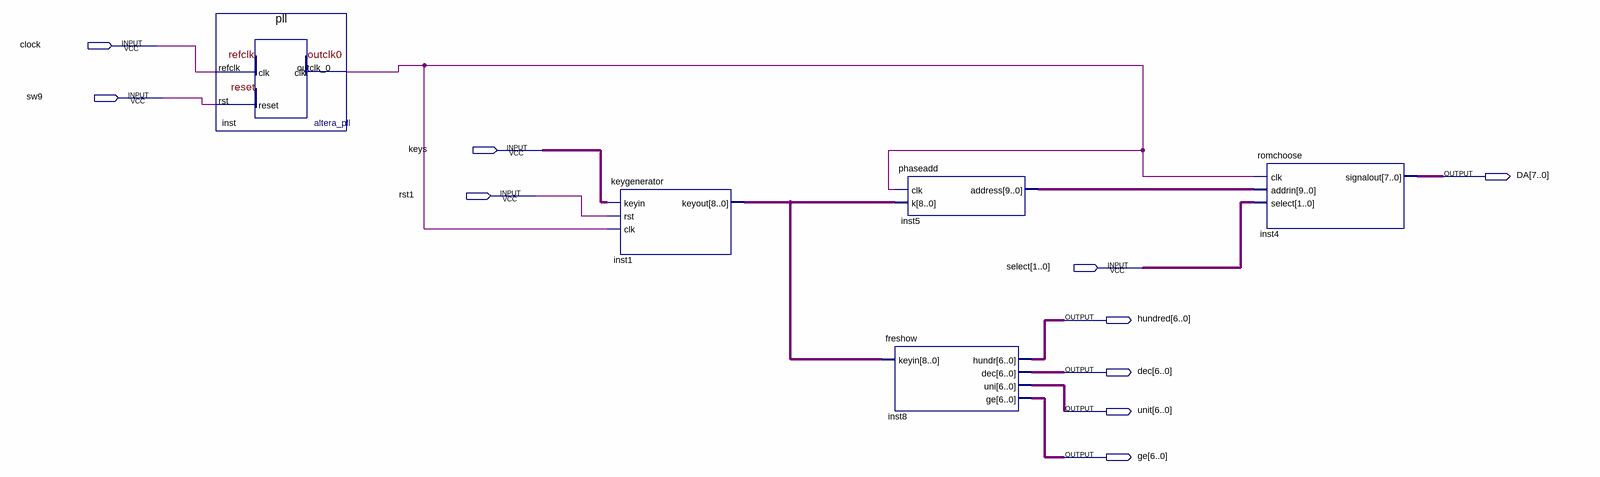
[diagram p0: schematic sheet]
// Quartus schematic ddsgenerator.bdf as structural Verilog: 5 symbols, 10 pins
module ddsgenerator (
  input  clock,
  input  sw9,
  input  keys,
  input  rst1,
  input  [1:0] select,
  output [7:0] DA,
  output [6:0] hundred,
  output [6:0] dec,
  output [6:0] unit,
  output [6:0] ge
);

  wire inst_outclk_0;
  wire [8:0] inst1_keyout;
  wire [9:0] inst5_address;

  pll inst (.refclk(clock), .rst(sw9), .outclk_0(inst_outclk_0));
  keygenerator inst1 (.keyin(keys), .rst(rst1), .clk(inst_outclk_0), .keyout(inst1_keyout));
  phaseadd inst5 (.clk(inst_outclk_0), .k(inst1_keyout), .address(inst5_address));
  freshow inst8 (.keyin(inst1_keyout), .hundr(hundred), .dec(dec), .uni(unit), .ge(ge));
  romchoose inst4 (.clk(inst_outclk_0), .addrin(inst5_address), .select(select), .signalout(DA));
endmodule
